# EAGLE design v0 (EAGLE 9.4.1)

## Sheet 1 of 2
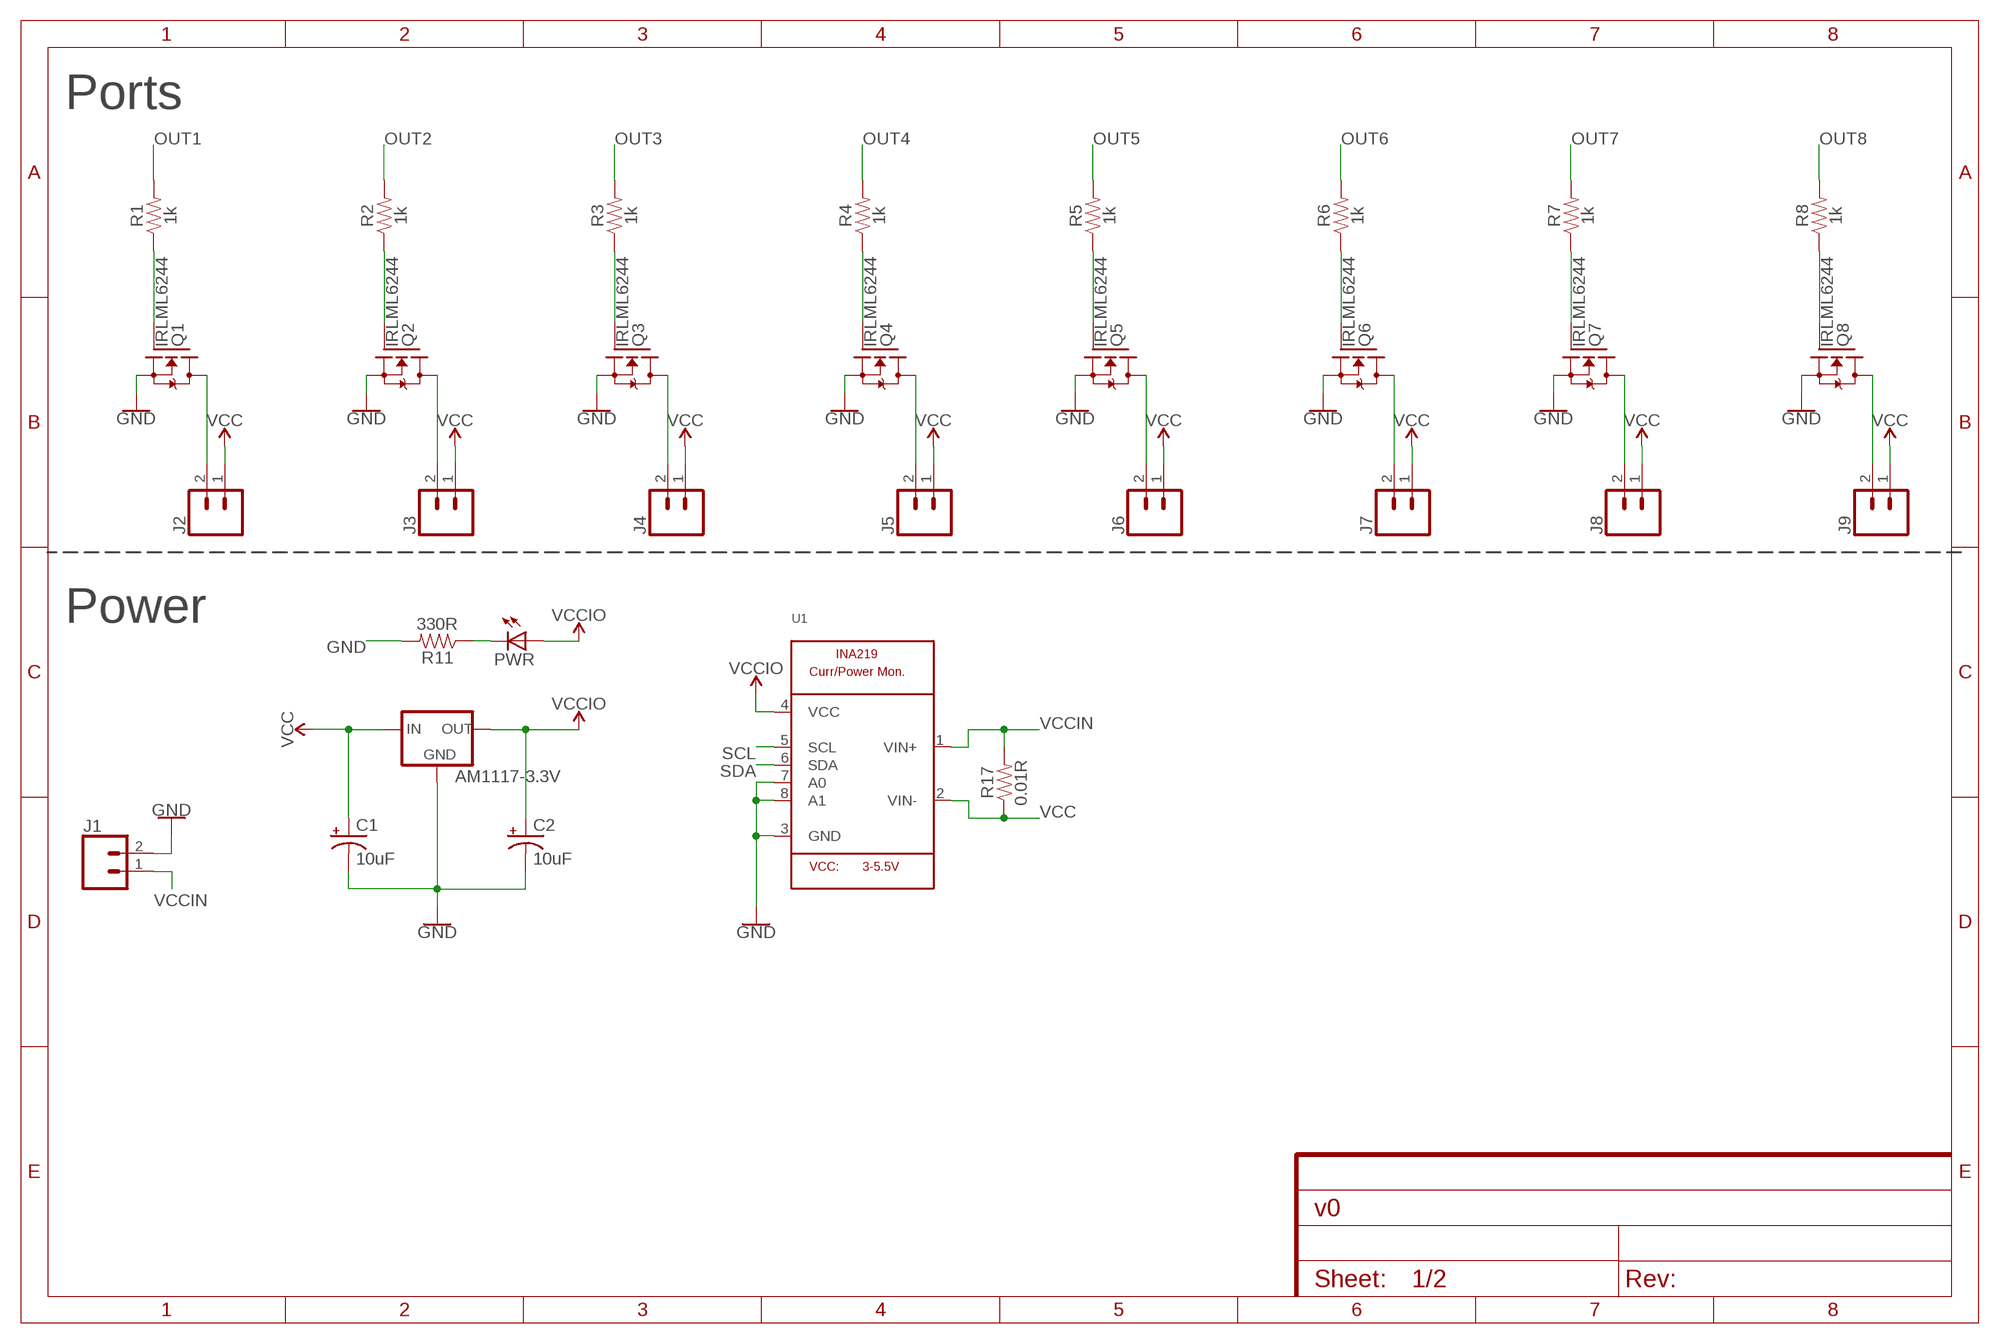
[diagram p0: schematic, sheet 1]

### Parts
AM1117-3.3V  V_REG_LD1117VXXLD1117-SMD  [SOT223]
C1  10uF  10UF-TANT  [EIA3216]
C2  10uF  10UF-TANT  [EIA3216]
J1  CONN_025MM  [SCREWTERMINAL-5MM-2]
J2  CONN_025MM  [SCREWTERMINAL-5MM-2]
J3  CONN_025MM  [SCREWTERMINAL-5MM-2]
J4  CONN_025MM  [SCREWTERMINAL-5MM-2]
J5  CONN_025MM  [SCREWTERMINAL-5MM-2]
J6  CONN_025MM  [SCREWTERMINAL-5MM-2]
J7  CONN_025MM  [SCREWTERMINAL-5MM-2]
J8  CONN_025MM  [SCREWTERMINAL-5MM-2]
J9  CONN_025MM  [SCREWTERMINAL-5MM-2]
PWR  LEDCHIP-LED0805  [CHIP-LED0805]
Q1  IRLML6244  [SOT23]
Q2  IRLML6244  [SOT23]
Q3  IRLML6244  [SOT23]
Q4  IRLML6244  [SOT23]
Q5  IRLML6244  [SOT23]
Q6  IRLML6244  [SOT23]
Q7  IRLML6244  [SOT23]
Q8  IRLML6244  [SOT23]
R1  1k  RESISTOR0805  [0805]
R2  1k  RESISTOR0805  [0805]
R3  1k  RESISTOR0805  [0805]
R4  1k  RESISTOR0805  [0805]
R5  1k  RESISTOR0805  [0805]
R6  1k  RESISTOR0805  [0805]
R7  1k  RESISTOR0805  [0805]
R8  1k  RESISTOR0805  [0805]
R11  330R  RESISTOR0805  [0805]
R17  0.01R  0.05OHM-2512-3W-1%  [2512]
U1  INA219  [SOT23-8]

### Nets
GND: AM1117-3.3V.1(GND) C1.C(-) C2.C(-) J1.2 Q1.2(S) Q2.2(S) Q3.2(S) Q4.2(S) Q5.2(S) Q6.2(S) Q7.2(S) Q8.2(S) R11.2 U1.3(GND) U1.7(A0) U1.8(A1) ; also sheet 2
N$1: J2.2 Q1.3(D)
N$2: J3.2 Q2.3(D)
N$3: J4.2 Q3.3(D)
N$4: J5.2 Q4.3(D)
N$5: J6.2 Q5.3(D)
N$6: J7.2 Q6.3(D)
N$7: J8.2 Q7.3(D)
N$8: J9.2 Q8.3(D)
N$9: Q1.1(G) R1.1
N$10: Q2.1(G) R2.1
N$11: Q3.1(G) R3.1
N$12: Q4.1(G) R4.1
N$13: Q5.1(G) R5.1
N$14: Q6.1(G) R6.1
N$15: Q7.1(G) R7.1
N$16: Q8.1(G) R8.1
N$17: PWR.C R11.1
OUT1: R1.2 ; also sheet 2
OUT2: R2.2 ; also sheet 2
OUT3: R3.2 ; also sheet 2
OUT4: R4.2 ; also sheet 2
OUT5: R5.2 ; also sheet 2
OUT6: R6.2 ; also sheet 2
OUT7: R7.2 ; also sheet 2
OUT8: R8.2 ; also sheet 2
SCL: U1.5(SCL) ; also sheet 2
SDA: U1.6(SDA) ; also sheet 2
VCC: AM1117-3.3V.3(IN) C1.A(+) J2.1 J3.1 J4.1 J5.1 J6.1 J7.1 J8.1 J9.1 R17.P$1 U1.2(VIN-)
VCCIN: J1.1 R17.P$2 U1.1(VIN+)
VCCIO: AM1117-3.3V.2(OUT) C2.A(+) PWR.A U1.4(VCC) ; also sheet 2

### Notes on the sheet
- Ports
- Power

## Sheet 2 of 2
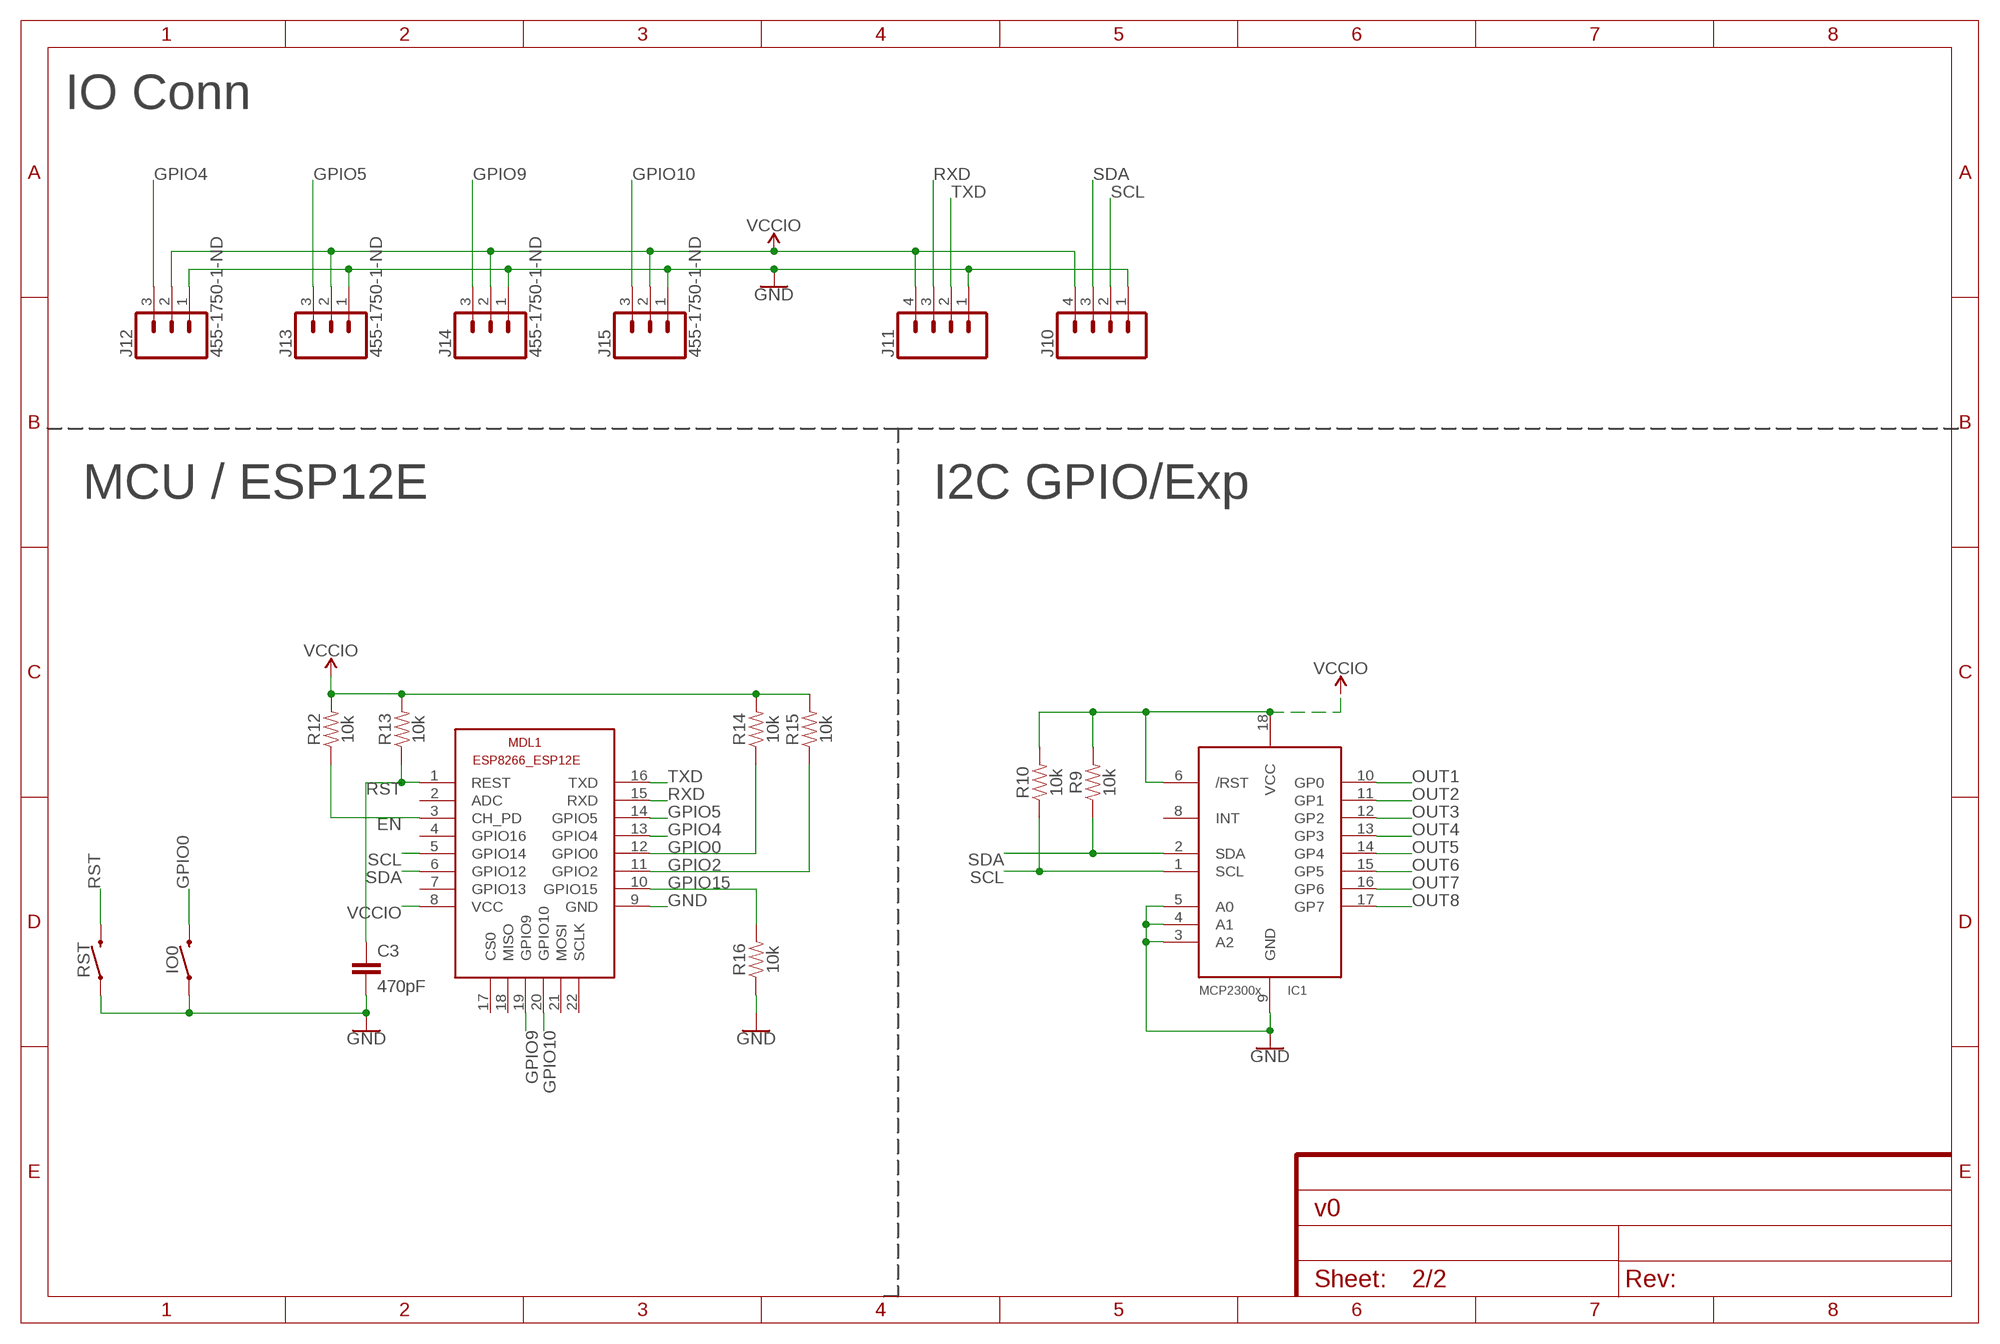
[diagram p1: schematic, sheet 2]

### Parts
C3  470pF  1.0UF-0805-25V-(+80/-20%)  [0805]
IC1  MCP23008/SO  [SO18W]
IO0  MOMENTARY-SWITCH-SPST-SMD-6.0X3.5MM  [TACTILE_SWITCH_SMD_6.0X3.5MM]
J10  CONN_04PTH  [1X04]
J11  CONN_04PTH  [1X04]
J12  455-1750-1-ND  CONN_03  [1X03]
J13  455-1750-1-ND  CONN_03  [1X03]
J14  455-1750-1-ND  CONN_03  [1X03]
J15  455-1750-1-ND  CONN_03  [1X03]
MDL1  ESP8266-12EESP8266-ESP12E  [ESP8266-ESP12E]
R9  10k  RESISTOR0805  [0805]
R10  10k  RESISTOR0805  [0805]
R12  10k  RESISTOR0805  [0805]
R13  10k  RESISTOR0805  [0805]
R14  10k  RESISTOR0805  [0805]
R15  10k  RESISTOR0805  [0805]
R16  10k  RESISTOR0805  [0805]
RST  MOMENTARY-SWITCH-SPST-SMD-6.0X3.5MM  [TACTILE_SWITCH_SMD_6.0X3.5MM]

### Nets
EN: MDL1.3(CH_PD) R12.1
GND: C3.2 IC1.3(A2) IC1.4(A1) IC1.5(A0) IC1.9(GND) IO0.1 J10.1 J11.1 J12.1 J13.1 J14.1 J15.1 MDL1.9(GND) R16.1 RST.1 ; also sheet 1
GPIO0: IO0.2 MDL1.12(GPIO0) R14.1
GPIO2: MDL1.11(GPIO2) R15.1
GPIO4: J12.3 MDL1.13(GPIO4)
GPIO5: J13.3 MDL1.14(GPIO5)
GPIO9: J14.3 MDL1.19(GPIO9)
GPIO10: J15.3 MDL1.20(GPIO10)
GPIO15: MDL1.10(GPIO15) R16.2
OUT1: IC1.10(GP0) ; also sheet 1
OUT2: IC1.11(GP1) ; also sheet 1
OUT3: IC1.12(GP2) ; also sheet 1
OUT4: IC1.13(GP3) ; also sheet 1
OUT5: IC1.14(GP4) ; also sheet 1
OUT6: IC1.15(GP5) ; also sheet 1
OUT7: IC1.16(GP6) ; also sheet 1
OUT8: IC1.17(GP7) ; also sheet 1
RST: C3.1 MDL1.1(REST) R13.1 RST.2
RXD: J11.3 MDL1.15(RXD)
SCL: IC1.1(SCL) J10.2 MDL1.5(GPIO14) R10.1 ; also sheet 1
SDA: IC1.2(SDA) J10.3 MDL1.6(GPIO12) R9.1 ; also sheet 1
TXD: J11.2 MDL1.16(TXD)
VCCIO: IC1.6(/RST) IC1.18(VCC) J10.4 J11.4 J12.2 J13.2 J14.2 J15.2 MDL1.8(VCC) R9.2 R10.2 R12.2 R13.2 R14.2 R15.2 ; also sheet 1
Unconnected: IC1.8(INT) MDL1.2(ADC) MDL1.4(GPIO16) MDL1.7(GPIO13) MDL1.17(CS0) MDL1.18(MISO) MDL1.21(MOSI) MDL1.22(SCLK)

### Notes on the sheet
- IO Conn
- MCU / ESP12E | I2C GPIO/Exp

## Library data of the parts
AM1117-3.3V = SparkFun-IC-Power:V_REG_LD1117VXX: LD1117VXX voltage regulator. We carry the 3.3V version (COM-00526) in TO-220 package.; PROD_ID: VREG-13917
C1 C2 = SparkFun-Retired:10UF-TANT: 10uF Tantalum SMT CAP-00811- 16V 10% (EIA-3216); PROD_ID: CAP-00811
C3 = SparkFun-Capacitors:1.0UF: 1µF ceramic capacitors A capacitor is a passive two-terminal electrical component used to store electrical energy temporarily in an electric field.; PROD_ID: CAP-11625; VALUE: 1.0uF
IC1 = adafruit:MCP23008: MCP23008 Inexpensive i2c i/o expander - 8 general purpose i/o pins with optional pullups
IO0 RST = SparkFun-Switches:MOMENTARY-SWITCH-SPST: Momentary Switch (Pushbutton) - SPST Normally-open (NO) SPST momentary switches (buttons, pushbuttons). Variants PTH-12MM - 12mm square, through-hole Momentary Pushbutton Switch - 12mm Square <https://www.sparkfun.com/products/9190> (COM-09190) PTH-6.0MM, PTH-6.0MM-KIT - 6.0mm square, through-hole Mini Pushbutton Switch <https://www.sparkfun.com/products/97> (COM-00097) KIT package intended for soldering kit's - only one side of pads' copper is exposed. PTH-RIGHT-ANGLE-KIT - Right-angle, through-hole Right Angle Tactile Button <https://www.sparkfun.com/products/10791> - Used on SparkFun BigTime Watch Kit <https://www.sparkfun.com/products/11734> SMD-12MM - 12mm square, surface-mount Tactile Button - SMD (12mm) <https://www.sparkfun.com/products/12993> (COM-12993) Used on SparkFun PicoBoard <https://www.sparkfun.com/products/11888> SMD-4.5MM - 4.5mm Square Trackball Switch Used on SparkFun Blackberry Trackballer Breakout <https://www.sparkfun.com/products/13169> SMD-4.6MMX2.8MM - 4.60mm x 2.80mm, surface mount Used on SparkFun SAMD21 Mini Breakout <https://www.sparkfun.com/products/13664> SMD-5.2MM, SMD-5.2-REDUNDANT - 5.2mm square, surface-mount Mini Pushbutton Switch - SMD <https://www.sparkfun.com/products/8720> (COM-08720) Used on Arduino Pro Mini <https://www.sparkfun.com/products/11114> REDUNDANT package connects both switch circuits together SMD-6.0X3.5MM - 6.0 x 3.5mm, surface mount Momentary Reset Switch SMD <https://www.sparkfun.com/products/8229> (COM-08229) SMD-6.2MM-TALL - 6.2mm square, surface mount Tactile Button - SMD (6mm) <https://www.sparkfun.com/products/12992> Used on SparkFun Digital Sandbox <https://www.sparkfun.com/products/12651> SMD-RIGHT-ANGLE - Right-angle, surface mount Used on SparkFun Block for Intel® Edison - Arduino <https://www.sparkfun.com/products/13036>; PROD_ID: SWCH-00815; SF_SKU: COM-08229
J1 J3-J9 = SparkFun-Connectors:CONN_02: Multi connection point. Often used as Generic Header-pin footprint for 0.1 inch spaced/style header connections On any of the 0.1 inch spaced packages, you can populate with these: Break Away Headers - Straight <https://www.sparkfun.com/products/116> (PRT-00116) Break Away Male Headers - Right Angle <https://www.sparkfun.com/products/553> (PRT-00553) Female Headers <https://www.sparkfun.com/products/115> (PRT-00115) Break Away Headers - Machine Pin <https://www.sparkfun.com/products/117> (PRT-00117) Break Away Female Headers - Swiss Machine Pin <https://www.sparkfun.com/products/743> (PRT-00743) For SCREWTERMINALS and SPRING TERMINALS visit here: Screw Terimnals on SparkFun.com <https://www.sparkfun.com/search/results?term=Screw+Terminals> (5mm/3.5mm/2.54mm spacing) This device is also useful as a general connection point to wire up your design to another part of your project. Our various solder wires solder well into these plated through hole pads. Hook-Up Wire - Assortment (Stranded, 22 AWG) <https://www.sparkfun.com/products/11375> (PRT-11375) Hook-Up Wire - Assortment (Solid Core, 22 AWG) <https://www.sparkfun.com/products/11367> (PRT-11367) View the entire wire category on our website here <https://www.sparkfun.com/categories/141> Special notes: Molex polarized connector foot print use with: PRT-08233 with associated crimp pins and housings. 2.54_SCREWTERM for use with PRT-10571. 3.5mm Screw Terminal footprints for PRT-08084 5mm Screw Terminal footprints for use with PRT-08432; SF_SKU: PRT-08432
J2 = SparkFun-Connectors:CONN_02: Multi connection point. Often used as Generic Header-pin footprint for 0.1 inch spaced/style header connections On any of the 0.1 inch spaced packages, you can populate with these: Break Away Headers - Straight <https://www.sparkfun.com/products/116> (PRT-00116) Break Away Male Headers - Right Angle <https://www.sparkfun.com/products/553> (PRT-00553) Female Headers <https://www.sparkfun.com/products/115> (PRT-00115) Break Away Headers - Machine Pin <https://www.sparkfun.com/products/117> (PRT-00117) Break Away Female Headers - Swiss Machine Pin <https://www.sparkfun.com/products/743> (PRT-00743) For SCREWTERMINALS and SPRING TERMINALS visit here: Screw Terimnals on SparkFun.com <https://www.sparkfun.com/search/results?term=Screw+Terminals> (5mm/3.5mm/2.54mm spacing) This device is also useful as a general connection point to wire up your design to another part of your project. Our various solder wires solder well into these plated through hole pads. Hook-Up Wire - Assortment (Stranded, 22 AWG) <https://www.sparkfun.com/products/11375> (PRT-11375) Hook-Up Wire - Assortment (Solid Core, 22 AWG) <https://www.sparkfun.com/products/11367> (PRT-11367) View the entire wire category on our website here <https://www.sparkfun.com/categories/141> Special notes: Molex polarized connector foot print use with: PRT-08233 with associated crimp pins and housings. 2.54_SCREWTERM for use with PRT-10571. 3.5mm Screw Terminal footprints for PRT-08084 5mm Screw Terminal footprints for use with PRT-08432; SF_SKU: PRT-08432; SPICEPREFIX: B
J10 J11 = SparkFun-Connectors:CONN_04: Multi connection point. Often used as Generic Header-pin footprint for 0.1 inch spaced/style header connections On any of the 0.1 inch spaced packages, you can populate with these: Break Away Headers - Straight <https://www.sparkfun.com/products/116> (PRT-00116) Break Away Male Headers - Right Angle <https://www.sparkfun.com/products/553> (PRT-00553) Female Headers <https://www.sparkfun.com/products/115> (PRT-00115) Break Away Headers - Machine Pin <https://www.sparkfun.com/products/117> (PRT-00117) Break Away Female Headers - Swiss Machine Pin <https://www.sparkfun.com/products/743> (PRT-00743) For SCREWTERMINALS and SPRING TERMINALS visit here: Screw Terimnals on SparkFun.com <https://www.sparkfun.com/search/results?term=Screw+Terminals> (5mm/3.5mm/2.54mm spacing) This device is also useful as a general connection point to wire up your design to another part of your project. Our various solder wires solder well into these plated through hole pads. Hook-Up Wire - Assortment (Stranded, 22 AWG) <https://www.sparkfun.com/products/11375> (PRT-11375) Hook-Up Wire - Assortment (Solid Core, 22 AWG) <https://www.sparkfun.com/products/11367> (PRT-11367) View the entire wire category on our website here <https://www.sparkfun.com/categories/141> Special notes: Molex polarized connector foot print use with SKU : PRT-08231 with associated crimp pins and housings. 1MM SMD Version SKU: PRT-10208; PROD_ID: CONN-09696
J12-J15 = SparkFun-Connectors:CONN_03: Multi connection point. Often used as Generic Header-pin footprint for 0.1 inch spaced/style header connections On any of the 0.1 inch spaced packages, you can populate with these: Break Away Headers - Straight <https://www.sparkfun.com/products/116> (PRT-00116) Break Away Male Headers - Right Angle <https://www.sparkfun.com/products/553> (PRT-00553) Female Headers <https://www.sparkfun.com/products/115> (PRT-00115) Break Away Headers - Machine Pin <https://www.sparkfun.com/products/117> (PRT-00117) Break Away Female Headers - Swiss Machine Pin <https://www.sparkfun.com/products/743> (PRT-00743) Stackable Header - 3 Pin (Female, 0.1") <https://www.sparkfun.com/products/13875> (PRT-13875) For SCREWTERMINALS and SPRING TERMINALS visit here: Screw Terimnals on SparkFun.com <https://www.sparkfun.com/search/results?term=Screw+Terminals> (5mm/3.5mm/2.54mm spacing) This device is also useful as a general connection point to wire up your design to another part of your project. Our various solder wires solder well into these plated through hole pads. Hook-Up Wire - Assortment (Stranded, 22 AWG) <https://www.sparkfun.com/products/11375> (PRT-11375) Hook-Up Wire - Assortment (Solid Core, 22 AWG) <https://www.sparkfun.com/products/11367> (PRT-11367) View the entire wire category on our website here <https://www.sparkfun.com/categories/141> Special notes: Molex polarized connector foot print use with SKU : PRT-08232 with associated crimp pins and housings.; PROD_ID: XXX-00000
MDL1 = ESP8266-ESP12E:ESP8266-12E: ESP8266-12E with additional I/O and GPIO04/05 corrected The author cannot warrant that this library is free from error or will meet your specific requirements. Created by PuceBaboon.com. Komagane, Nagano, JAPAN
PWR = adafruit:LED: LED OSRAM: - CHIPLED LG R971, LG N971, LY N971, LG Q971, LY Q971, LO R971, LY R971 LH N974, LH R974 LS Q976, LO Q976, LY Q976 LO Q996 - Hyper CHIPLED LW Q18S LB Q993, LB Q99A, LB R99A - SideLED LS A670, LO A670, LY A670, LG A670, LP A670 LB A673, LV A673, LT A673, LW A673 LH A674 LY A675 LS A676, LA A676, LO A676, LY A676, LW A676 LS A679, LY A679, LG A679 - Hyper Micro SIDELED® LS Y876, LA Y876, LO Y876, LY Y876 LT Y87S - SmartLED LW L88C, LW L88S LB L89C, LB L89S, LG L890 LS L89K, LO L89K, LY L89K LS L896, LA L896, LO L896, LY L896 - TOPLED LS T670, LO T670, LY T670, LG T670, LP T670 LSG T670, LSP T670, LSY T670, LOP T670, LYG T670 LG T671, LOG T671, LSG T671 LB T673, LV T673, LT T673, LW T673 LH T674 LS T676, LA T676, LO T676, LY T676, LB T676, LH T676, LSB T676, LW T676 LB T67C, LV T67C, LT T67C, LS T67K, LO T67K, LY T67K, LW E67C LS E67B, LA E67B, LO E67B, LY E67B, LB E67C, LV E67C, LT E67C LW T67C LS T679, LY T679, LG T679 LS T770, LO T770, LY T770, LG T770, LP T770 LB T773, LV T773, LT T773, LW T773 LH T774 LS E675, LA E675, LY E675, LS T675 LS T776, LA T776, LO T776, LY T776, LB T776 LHGB T686 LT T68C, LB T68C - Hyper Mini TOPLED® LB M676 - Mini TOPLED Santana® LG M470 LS M47K, LO M47K, LY M47K Source: http://www.osram.convergy.de/
Q1 = bytewerk-transistor:IRLML6244: n-channel FET Vds=20V Vgs=+-12V Icont=6A; MF: Internat. Rectifier; MPN: IRLML6244TRPbF; OC_FARNELL: 1864517RL; SPICEPREFIX: Q
Q2-Q8 = bytewerk-transistor:IRLML6244: n-channel FET Vds=20V Vgs=+-12V Icont=6A; MF: Internat. Rectifier; MPN: IRLML6244TRPbF; OC_FARNELL: 1864517RL
R1 = SparkFun-Resistors:RESISTOR: Generic Resistor Package; SPICEPREFIX: R
R2-R16 = SparkFun-Resistors:RESISTOR: Generic Resistor Package
R17 = SparkFun-Resistors:0.05OHM: 0.05Ω resistor A resistor is a passive two-terminal electrical component that implements electrical resistance as a circuit element. Resistors act to reduce current flow, and, at the same time, act to lower voltage levels within circuits. - Wikipedia; PROD_ID: RES-13771; VALUE: 0.05
U1 = INA219:INA219: INA219 - I2C Current/Power Monitor Voltage Range: 0-26V Accuracy: 0.5% Temperature: -40°C - 125°C

## Board
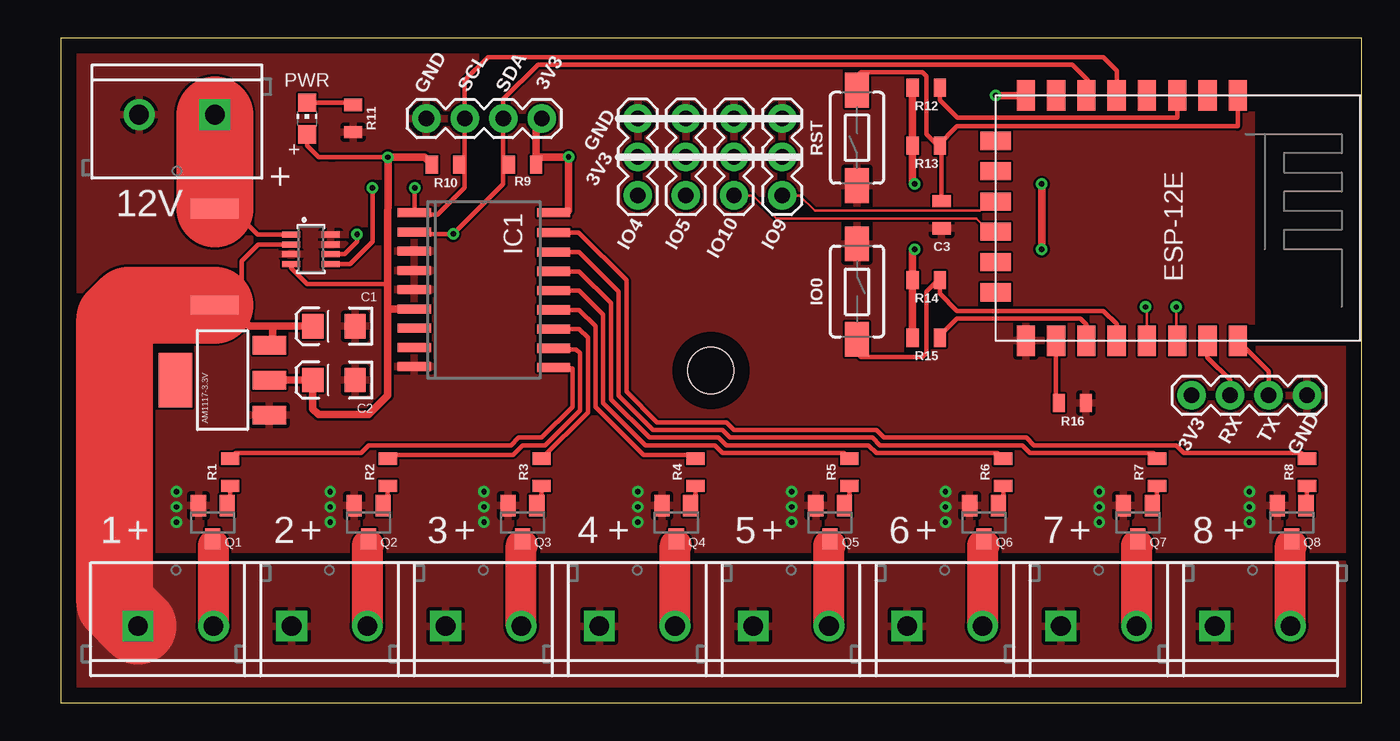
[diagram p2: board, top side]
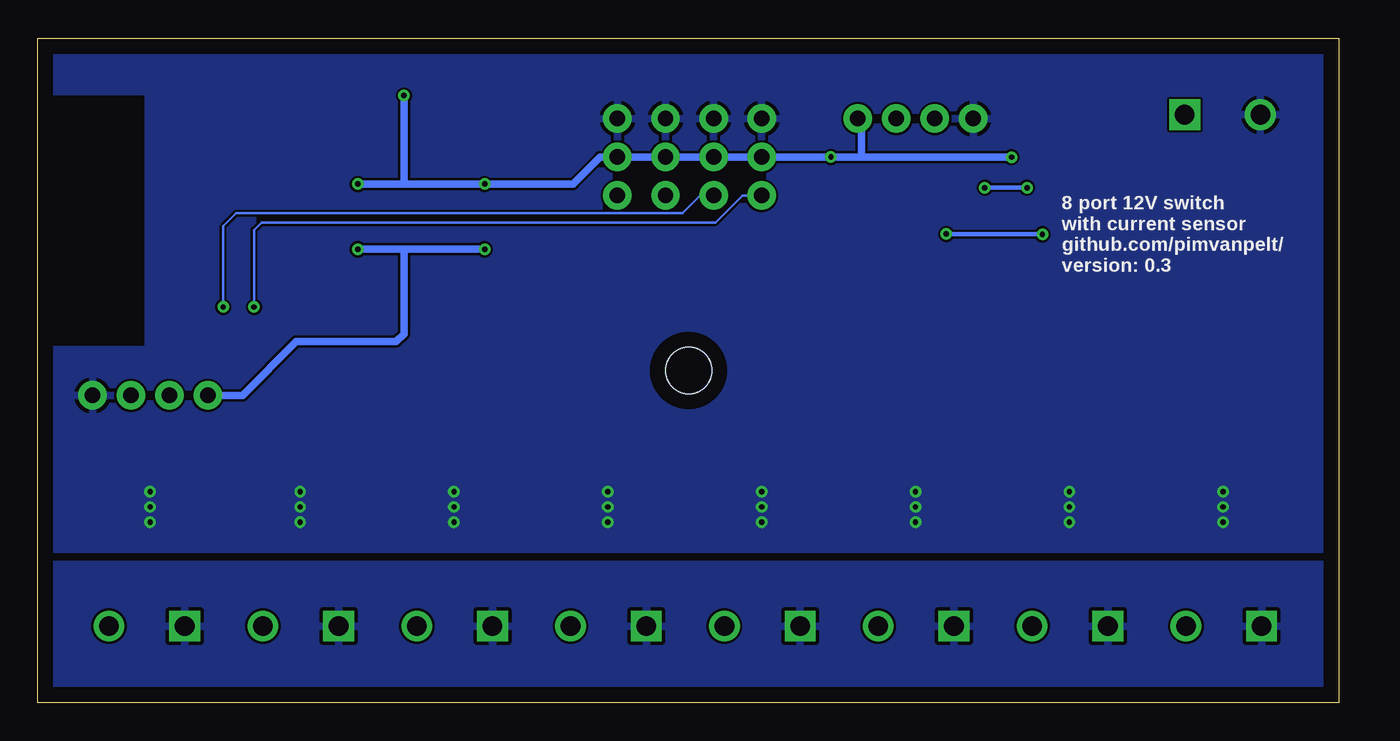
[diagram p3: board, bottom side, seen from below]

Size 85.9 x 43.93 mm. Coordinates in mm from the lower left corner, seen from the top.
Outline: 0,0 85.9,0 85.9,43.93 0,43.93 0,0
Copper layers (1*16): Top 0.035mm / dielectric 1.5mm / Bottom 0.035mm
Design rules "default": minimum track width 6mil, minimum drill 0.35mm, track to track 6mil, track to pad 6mil, pad to pad 6mil, via to via 6mil, smd to smd 6mil, copper to edge 40mil, drill to drill 6mil, minimum pad ring 10mil, minimum via ring 8mil, stop-mask expansion 4mil, vias tented up to drill 0mil, thermal gap 10mil
Holes 3.05 mm at 42.93,21.97

### Footprints (pad centres in the part's own frame; a part is rotated, then mirrored left to right if it is on the bottom)
SOT223 = smd 1.219 x 2.235: 1 -2.311,-3.099; 2 0,-3.099; 3 2.311,-3.099 | smd 3.6 x 2.2: 4 0,3.099
EIA3216 = smd 1.4 x 1.6: A 1.4,0; C -1.4,0
0805 = smd 0.8 x 1.2: 1 -0.9,0; 2 0.9,0
SO18W = smd 0.6 x 2.2: 1 -4.445,-4.6; 2 -3.175,-4.6; 3 -1.905,-4.6; 4 -0.635,-4.6; 5 0.635,-4.6; 6 1.905,-4.6; 7 3.175,-4.6; 8 4.445,-4.6; 9 5.715,-4.6; 10 5.775,4.6; 11 4.505,4.6; 12 3.235,4.6; 13 1.965,4.6; 14 0.695,4.6; 15 -0.575,4.6; 16 -1.845,4.6; 17 -3.145,4.6; 18 -4.445,4.6
TACTILE_SWITCH_SMD_6.0X3.5MM = smd 2.3 x 1.6: 1 -3.15,0; 2 3.15,0
SCREWTERMINAL-5MM-2 = drill 1.3 pad 2.032 square: 1 0,0 | drill 1.3 pad 2.032: 2 5,0
1X04 = drill 1.016 pad 1.88: 1 0,0; 2 2.54,0; 3 5.08,0; 4 7.62,0
1X03 = drill 1.016 pad 1.88: 1 0,0; 2 2.54,0; 3 5.08,0
ESP8266-ESP12E = smd 2 x 1.2: 1 -7.62,5.84; 2 -7.62,3.84; 3 -7.62,1.84; 4 -7.62,-0.16; 5 -7.62,-2.16; 6 -7.62,-4.16; 7 -7.62,-6.16; 8 -7.62,-8.16; 9 8.58,-8.16; 10 8.58,-6.16; 11 8.58,-4.16; 12 8.58,-2.16; 13 8.58,-0.16; 14 8.58,1.84; 15 8.58,3.84; 16 8.58,5.84 | smd 1.2 x 2: 17 -4.62,-10.16; 18 -2.62,-10.16; 19 -0.62,-10.16; 20 1.38,-10.16; 21 3.38,-10.16; 22 5.38,-10.16
CHIP-LED0805 = smd 1.2 x 1.2: A 0,-1.05; C 0,1.05
SOT23 = smd 1 x 1.4: 1 -0.95,-1.1; 2 0.95,-1.1; 3 0,1.1
2512 = smd 1.27 x 3.175: P$1 -3.175,0; P$2 3.175,0
SOT23-8 = smd 0.4 x 1.2: 1 -0.975,-1.3; 2 -0.325,-1.3; 3 0.325,-1.3; 4 0.975,-1.3; 5 0.975,1.3; 6 0.325,1.3; 7 -0.325,1.3; 8 -0.975,1.3

### Placement (x,y rotation side)
AM1117-3.3V  10.67,21.34 90 top
C1  18.03,24.89 180 top
C2  18.03,21.34 180 top
C3  58.17,32.26 270 top
IC1  27.94,27.94 270 top
IO0  52.58,27.18 270 top
J1  10.16,38.86 180 top
J2  5.08,5.08 0 top
J3  15.24,5.08 0 top
J4  25.4,5.08 0 top
J5  35.56,5.08 0 top
J6  45.72,5.08 0 top
J7  55.88,5.08 0 top
J8  66.04,5.08 0 top
J9  76.2,5.08 0 top
J10  24.13,38.61 0 top
J11  82.3,20.32 180 top
J12  38.1,38.61 270 top
J13  41.27,38.61 270 top
J14  47.62,38.61 270 top
J15  44.45,38.61 270 top
MDL1  71.88,32.51 270 top
PWR  16.26,38.61 0 top
Q1  10.03,11.94 180 top
Q2  20.32,11.94 180 top
Q3  30.48,11.94 180 top
Q4  40.64,11.94 180 top
Q5  50.8,11.94 180 top
Q6  60.96,11.94 180 top
Q7  71.12,11.94 180 top
Q8  81.28,11.94 180 top
R1  11.18,15.24 90 top
R2  21.59,15.24 90 top
R3  31.75,15.24 90 top
R4  41.91,15.24 90 top
R5  52.07,15.24 90 top
R6  62.23,15.24 90 top
R7  72.39,15.24 90 top
R8  82.3,15.24 90 top
R9  30.48,35.56 0 top
R10  25.4,35.56 180 top
R11  19.3,38.61 270 top
R12  57.15,40.64 180 top
R13  57.15,36.83 180 top
R14  57.15,27.94 180 top
R15  57.15,24.13 180 top
R16  66.8,19.81 180 top
R17  10.16,29.46 90 top
RST  52.58,37.34 90 top
U1  16.51,29.97 270 top

### Tracks (layer width: path | path; a pad name or v marks a point on that pad's centre or on a via)
EN
  Top 0.305: R12.1 58.05,39.84 59.22,38.67 73.72,38.67 MDL1.3
GND  (via drill 0.35)
  other vias: 7.62,13.97 7.62,12.95 7.62,11.94 17.78,13.97 17.78,12.95 17.78,11.94 27.94,13.97 27.94,12.95 27.94,11.94 38.1,13.97 38.1,12.95 38.1,11.94 58.42,13.97 58.42,12.95 58.42,11.94 68.58,13.97 68.58,12.95 68.58,11.94 78.49,13.97 78.49,12.95 78.49,11.94 48.26,13.97 48.26,12.95 48.26,11.94
  pour Top: 0.25,43.69 86.11,43.69 86.11,10.16 0.25,10.16
  pour Bottom: 0.25,43.69 86.11,43.69 86.11,10.16 0.25,10.16
GPIO0
  Top 0.305: MDL1.12 69.72,25.02 68.83,25.91 59.18,25.91 58.05,27.04 R14.1 57.91,27.94 57.15,27.18 57.15,23.11 56.9,22.86 52.83,22.86 52.58,23.11 IO0.2
GPIO2
  Top 0.305: MDL1.11 67.72,24.99 67.31,25.4 59.18,25.4 58.05,24.27 R15.1
GPIO4  (via drill 0.35)
  Top 0.152: MDL1.13 71.72,26.07 v71.63,26.16
  Bottom 0.152: v71.63,26.16 71.63,31.24 71.12,31.75 41.15,31.75 39.37,33.53 J12.3
GPIO5  (via drill 0.35)
  Top 0.152: MDL1.14 73.66,23.99 v73.66,26.16
  Bottom 0.152: v73.66,26.16 73.66,31.5 72.8,32.36 43.33,32.36 42.16,33.53 J13.3
GPIO9
  Top 0.152: MDL1.19 61.33,33.13 60.71,32.51 49.78,32.51 48.77,33.53 J14.3
GPIO10
  Top 0.152: MDL1.20 61.32,31.13 60.45,32 47.24,32 45.72,33.53 J15.3
GPIO15
  Top 0.305: MDL1.10 65.72,19.99 R16.2
N$1
  Top 0.305: Q1.3 10.08,10.84 10.08,10.41
  Top 2.032: J2.2 10.08,10.41
N$2
  Top 0.305: Q2.3 20.32,10.41
  Top 2.032: J3.2 20.24,10.41 20.32,10.41
N$3
  Top 0.305: Q3.3 30.48,10.41
  Top 2.032: J4.2 30.4,10.41 30.48,10.41
N$4
  Top 0.305: Q4.3 40.64,10.41
  Top 2.032: J5.2 40.56,10.41 40.64,10.41
N$5
  Top 0.305: Q5.3 50.8,10.41
  Top 2.032: J6.2 50.72,10.41 50.8,10.41
N$6
  Top 0.305: Q6.3 60.96,10.41
  Top 2.032: J7.2 60.88,10.41 60.96,10.41
N$7
  Top 0.305: Q7.3 71.12,10.41
  Top 2.032: J8.2 71.04,10.41 71.12,10.41
N$8
  Top 0.305: Q8.3 81.28,10.41
  Top 2.032: J9.2 81.2,10.41 81.28,10.41
N$9
  Top 0.305: R1.1 11.18,13.23 Q1.1
N$10
  Top 0.305: R2.1 21.59,13.36 Q2.1
N$11
  Top 0.305: R3.1 31.75,13.36 Q3.1
N$12
  Top 0.305: R4.1 41.91,13.36 Q4.1
N$13
  Top 0.305: R5.1 52.07,13.36 Q5.1
N$14
  Top 0.305: R6.1 62.23,13.36 Q6.1
N$15
  Top 0.305: R7.1 72.39,13.36 Q7.1
N$16
  Top 0.305: R8.1 82.3,13.1 Q8.1
N$17
  Top 0.305: PWR.C 19.15,39.66 R11.1
OUT1
  Top 0.305: IC1.10 32.61,22.1 33.78,22.1 33.78,19.56 31.75,17.53 30.23,17.53 29.72,17.02 20.32,17.02 19.81,16.51 11.55,16.51 R1.2
OUT2
  Top 0.305: IC1.11 32.61,23.37 34.04,23.37 34.29,23.11 34.29,19.33 31.98,17.02 30.48,17.02 29.86,16.39 21.59,16.39 R2.2
OUT3
  Top 0.305: IC1.12 34.22,24.7 34.8,24.13 34.8,19.19 R3.2
OUT4
  Top 0.305: IC1.13 34.22,25.98 35.31,24.89 35.31,19.56 38.47,16.39 41.66,16.39 R4.2
OUT5
  Top 0.305: IC1.14 34.22,27.25 35.81,25.65 35.81,19.81 38.61,17.02 43.18,17.02 43.69,16.51 51.7,16.51 R5.2
OUT6
  Top 0.305: IC1.15 34.22,28.52 36.32,26.42 36.32,20.07 38.86,17.53 43.43,17.53 43.94,17.02 53.34,17.02 53.85,16.51 61.86,16.51 R6.2
OUT7
  Top 0.305: IC1.16 34.22,29.79 36.83,27.18 36.83,20.32 39.12,18.03 43.69,18.03 44.2,17.53 53.59,17.53 54.1,17.02 63.5,17.02 64.01,16.51 72.14,16.51 72.39,16.26 R7.2
OUT8
  Top 0.305: IC1.17 34.19,31.09 37.34,27.94 37.34,20.57 39.37,18.54 43.94,18.54 44.45,18.03 53.85,18.03 54.36,17.53 63.75,17.53 64.26,17.02 73.66,17.02 74.17,16.51 81.93,16.51 R8.2
RST
  Top 0.305: C3.1 58.17,36.71 R13.1 57.91,36.83 | 57.91,36.83 57.15,37.59 57.15,41.4 56.9,41.66 52.83,41.66 52.58,41.4 RST.2 | MDL1.1 77.72,38.1 59.18,38.1 57.91,36.83
RXD
  Top 0.305: J11.3 77.22,21.34 75.72,22.83 MDL1.15
SCL  (via drill 0.35)
  Top 0.305: 26.67,35.56 J10.2 26.67,41.15 28.19,42.67 68.83,42.67 69.72,41.78 MDL1.5 | 26.67,35.56 26.67,34.04 24.89,32.26 23.47,32.26 IC1.1 23.37,32.41 v23.37,34.04 | R10.1 26.67,35.56 | U1.5 19.09,29 20.57,30.48 v20.57,34.04
  Bottom 0.305: v20.57,34.04 v23.37,34.04
SDA  (via drill 0.35)
  Top 0.305: 29.21,35.56 J10.3 29.21,39.88 31.5,42.16 66.8,42.16 67.82,41.15 67.82,40.23 MDL1.6 | 29.21,35.56 29.21,34.29 v25.91,30.99 23.47,30.99 IC1.2 | R9.1 29.21,35.56 | v19.56,30.96 19.56,30.48 18.73,29.65 U1.6
  Bottom 0.305: v25.91,30.99 19.59,30.99 v19.56,30.96
TXD
  Top 0.305: MDL1.16 79.76,21.9 J11.2
VCC
  Top 0.305: U1.2 13.03,30.3 11.94,29.21 11.94,27.18 11.05,26.29 10.92,26.16 10.79,26.29 R17.P$1
  Top 0.508: C1.A 13.97,24.89 | 13.97,24.89 12.45,24.89 11.05,26.29 | AM1117-3.3V.3 13.97,23.85 13.97,24.89
  Top 5.08: J2.1 3.56,6.6 3.56,25.4 4.45,26.29 R17.P$1
  pour Bottom: 0.25,9.14 86.11,9.14 86.11,0.25 0.25,0.25
  pour Top: 0.25,9.14 86.11,9.14 86.11,0.25 0.25,0.25
VCCIN
  Top 0.305: U1.1 12.99,30.95 11.3,32.64 R17.P$2
  Top 5.08: J1.1 R17.P$2
VCCIO  (via drill 0.35)
  Top 0.305: v21.6,36.06 18.03,36.06 17.76,36.06 17.03,36.06 16.26,36.83 PWR.A | U1.4 15.21,28.74 16.27,27.69 21.59,27.69
  Top 0.508: R9.2 31.38,36.07 | 31.38,36.07 31.38,38.24 J10.4 | R12.2 R13.2 56.25,34.43 v56.39,34.29 | R15.2 R14.2 56.25,29.83 v56.39,29.97 | v61.72,40.13 MDL1.8 | IC1.18 33.4,32.38 33.53,32.51 v33.53,36.07 31.38,36.07 | v64.77,29.97 v64.77,34.29 | R10.2 24,36.06 v21.6,36.06 21.59,29.21 21.59,27.69 21.59,25.91 | 21.59,25.91 21.59,20.32 20.32,19.05 17.02,19.05 16.63,19.43 C2.A AM1117-3.3V.2 | IC1.6 21.71,26.04 21.59,25.91
  Bottom 0.508: 31.5,36.06 33.53,36.06 v33.53,36.07 J12.2 J13.2 J15.2 J14.2 48.77,36.07 50.55,34.29 v56.39,34.29 61.72,34.29 | 31.5,36.06 v21.6,36.06 | v61.72,40.13 61.72,34.29 | 61.72,29.97 61.72,24.38 62.23,23.88 68.83,23.88 72.39,20.32 J11.4 | v56.39,29.97 61.72,29.97 | 61.72,29.97 v64.77,29.97 | v64.77,34.29 61.72,34.29 | J10.4 31.5,38.35 31.5,36.06

### Text on the board
tPlace: GND | SCL | SDA | 3V3 | GND | + | 3V3 | 12V | IO4 | IO5 | IO10 | IO9 | 3V3 | RX | TX | GND | 1 | + | 2 | + | 3 | + | 4 | + | 5 | + | 6 | + | 7 | + | 8 | +
bPlace: 8 port 12V switch / with current sensor / github.com/pimvanpelt/ / version: 0.3